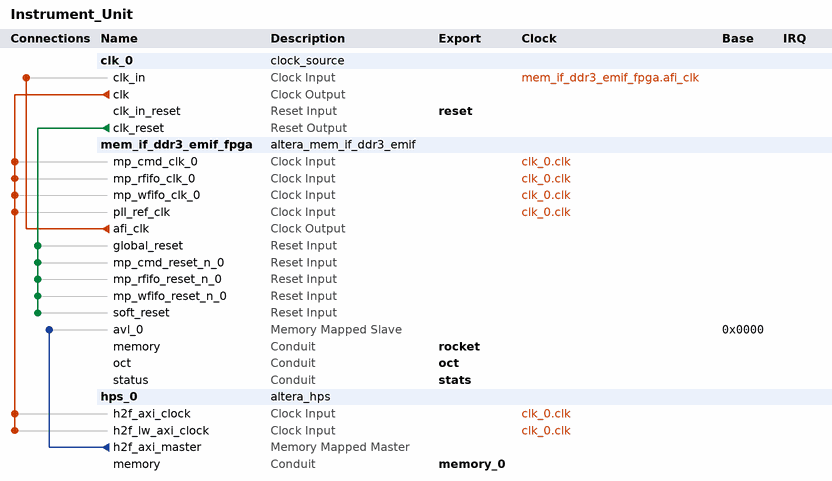
[diagram p0: system contents]
# Platform Designer (Qsys) system Instrument_Unit, Cyclone V 5CSXFC6D6F31C8ES
# Parameters at their usual value, and those the tool derives, are not listed.
package require -exact qsys 14.1
create_system Instrument_Unit
set_project_property DEVICE_FAMILY {Cyclone V}
set_project_property DEVICE 5CSXFC6D6F31C8ES

add_instance clk_0 clock_source 14.1
set_instance_parameter_value clk_0 clockFrequency 50000000

add_instance mem_if_ddr3_emif_fpga altera_mem_if_ddr3_emif 14.1
set_instance_parameter_value mem_if_ddr3_emif_fpga AVL_MAX_SIZE 4
set_instance_parameter_value mem_if_ddr3_emif_fpga CALIBRATION_MODE Full
set_instance_parameter_value mem_if_ddr3_emif_fpga CPORT_TYPE_PORT Bidirectional,Bidirectional,Bidirectional,Bidirectional,Bidirectional,Bidirectional
set_instance_parameter_value mem_if_ddr3_emif_fpga EXPORT_AFI_HALF_CLK false
set_instance_parameter_value mem_if_ddr3_emif_fpga HARD_EMIF true
set_instance_parameter_value mem_if_ddr3_emif_fpga MEM_BANKADDR_WIDTH 3
set_instance_parameter_value mem_if_ddr3_emif_fpga MEM_CLK_FREQ 300.0
set_instance_parameter_value mem_if_ddr3_emif_fpga MEM_CLK_FREQ_MAX 400.0
set_instance_parameter_value mem_if_ddr3_emif_fpga MEM_COL_ADDR_WIDTH 10
set_instance_parameter_value mem_if_ddr3_emif_fpga MEM_DQ_WIDTH 32
set_instance_parameter_value mem_if_ddr3_emif_fpga MEM_FORMAT DISCRETE
set_instance_parameter_value mem_if_ddr3_emif_fpga MEM_ROW_ADDR_WIDTH 15
set_instance_parameter_value mem_if_ddr3_emif_fpga MEM_TCL 6
set_instance_parameter_value mem_if_ddr3_emif_fpga MEM_TFAW_NS 50.0
set_instance_parameter_value mem_if_ddr3_emif_fpga MEM_TRAS_NS 37.5
set_instance_parameter_value mem_if_ddr3_emif_fpga MEM_TRCD_NS 15.0
set_instance_parameter_value mem_if_ddr3_emif_fpga MEM_TRFC_NS 300.0
set_instance_parameter_value mem_if_ddr3_emif_fpga MEM_TRP_NS 15.0
set_instance_parameter_value mem_if_ddr3_emif_fpga MEM_TRRD_NS 13.2
set_instance_parameter_value mem_if_ddr3_emif_fpga MEM_TRTP_NS 13.2
set_instance_parameter_value mem_if_ddr3_emif_fpga MEM_TWTR 4
set_instance_parameter_value mem_if_ddr3_emif_fpga MEM_VENDOR Micron
set_instance_parameter_value mem_if_ddr3_emif_fpga MEM_WTCL 5
set_instance_parameter_value mem_if_ddr3_emif_fpga PLL_LOCATION Top_Bottom
set_instance_parameter_value mem_if_ddr3_emif_fpga POWER_OF_TWO_BUS false
set_instance_parameter_value mem_if_ddr3_emif_fpga PRIORITY_PORT 1,1,1,1,1,1
set_instance_parameter_value mem_if_ddr3_emif_fpga RATE Full
set_instance_parameter_value mem_if_ddr3_emif_fpga REF_CLK_FREQ 50.0
set_instance_parameter_value mem_if_ddr3_emif_fpga SPEED_GRADE 8
set_instance_parameter_value mem_if_ddr3_emif_fpga TIMING_BOARD_AC_SKEW 0.03
set_instance_parameter_value mem_if_ddr3_emif_fpga TIMING_BOARD_AC_TO_CK_SKEW 0.0
set_instance_parameter_value mem_if_ddr3_emif_fpga TIMING_BOARD_DQ_TO_DQS_SKEW 0.0
set_instance_parameter_value mem_if_ddr3_emif_fpga TIMING_BOARD_MAX_CK_DELAY 0.03
set_instance_parameter_value mem_if_ddr3_emif_fpga TIMING_BOARD_MAX_DQS_DELAY 0.03
set_instance_parameter_value mem_if_ddr3_emif_fpga TIMING_BOARD_SKEW_BETWEEN_DQS 0.08
set_instance_parameter_value mem_if_ddr3_emif_fpga TIMING_BOARD_SKEW_CKDQS_DIMM_MAX 0.0
set_instance_parameter_value mem_if_ddr3_emif_fpga TIMING_BOARD_SKEW_CKDQS_DIMM_MIN 0.0
set_instance_parameter_value mem_if_ddr3_emif_fpga TIMING_BOARD_SKEW_WITHIN_DQS 0.01
set_instance_parameter_value mem_if_ddr3_emif_fpga TIMING_TDH 150
set_instance_parameter_value mem_if_ddr3_emif_fpga TIMING_TDQSCK 400
set_instance_parameter_value mem_if_ddr3_emif_fpga TIMING_TDQSQ 200
set_instance_parameter_value mem_if_ddr3_emif_fpga TIMING_TDQSS 0.25
set_instance_parameter_value mem_if_ddr3_emif_fpga TIMING_TDS 75
set_instance_parameter_value mem_if_ddr3_emif_fpga TIMING_TDSH 0.2
set_instance_parameter_value mem_if_ddr3_emif_fpga TIMING_TDSS 0.2
set_instance_parameter_value mem_if_ddr3_emif_fpga TIMING_TIH 275
set_instance_parameter_value mem_if_ddr3_emif_fpga TIMING_TIS 200
set_instance_parameter_value mem_if_ddr3_emif_fpga TIMING_TQSH 0.38
set_instance_parameter_value mem_if_ddr3_emif_fpga USER_DEBUG_LEVEL 1

add_instance hps_0 altera_hps 14.1
set_instance_parameter_value hps_0 EMAC1_Mode N/A
set_instance_parameter_value hps_0 EMAC1_PinMuxing Unused
set_instance_parameter_value hps_0 F2SCLK_COLDRST_Enable false
set_instance_parameter_value hps_0 F2SCLK_DBGRST_Enable false
set_instance_parameter_value hps_0 F2SCLK_WARMRST_Enable false
set_instance_parameter_value hps_0 F2SINTERRUPT_Enable false
set_instance_parameter_value hps_0 F2S_Width 0
set_instance_parameter_value hps_0 FPGA_PERIPHERAL_OUTPUT_CLOCK_FREQ_EMAC0_GTX_CLK 100
set_instance_parameter_value hps_0 FPGA_PERIPHERAL_OUTPUT_CLOCK_FREQ_EMAC0_MD_CLK 100
set_instance_parameter_value hps_0 FPGA_PERIPHERAL_OUTPUT_CLOCK_FREQ_EMAC1_GTX_CLK 100
set_instance_parameter_value hps_0 FPGA_PERIPHERAL_OUTPUT_CLOCK_FREQ_EMAC1_MD_CLK 100
set_instance_parameter_value hps_0 HPS_PROTOCOL DDR3
set_instance_parameter_value hps_0 I2C0_Mode N/A
set_instance_parameter_value hps_0 I2C0_PinMuxing Unused
set_instance_parameter_value hps_0 I2C1_Mode N/A
set_instance_parameter_value hps_0 I2C1_PinMuxing Unused
set_instance_parameter_value hps_0 LWH2F_Enable true
set_instance_parameter_value hps_0 MEM_BANKADDR_WIDTH 3
set_instance_parameter_value hps_0 MEM_CLK_FREQ 300.0
set_instance_parameter_value hps_0 MEM_CLK_FREQ_MAX 400.0
set_instance_parameter_value hps_0 MEM_COL_ADDR_WIDTH 8
set_instance_parameter_value hps_0 MEM_DQ_WIDTH 8
set_instance_parameter_value hps_0 MEM_DRV_STR RZQ/6
set_instance_parameter_value hps_0 MEM_ROW_ADDR_WIDTH 12
set_instance_parameter_value hps_0 MEM_RTT_NOM RZQ/6
set_instance_parameter_value hps_0 MEM_RTT_WR {Dynamic ODT off}
set_instance_parameter_value hps_0 MEM_TCL 7
set_instance_parameter_value hps_0 MEM_TFAW_NS 37.5
set_instance_parameter_value hps_0 MEM_TINIT_US 499
set_instance_parameter_value hps_0 MEM_TMRD_CK 3
set_instance_parameter_value hps_0 MEM_TRAS_NS 40.0
set_instance_parameter_value hps_0 MEM_TRCD_NS 15.0
set_instance_parameter_value hps_0 MEM_TREFI_US 7.0
set_instance_parameter_value hps_0 MEM_TRFC_NS 75.0
set_instance_parameter_value hps_0 MEM_TRP_NS 15.0
set_instance_parameter_value hps_0 MEM_TWTR 2
set_instance_parameter_value hps_0 MEM_VENDOR Micron
set_instance_parameter_value hps_0 MEM_WTCL 6
set_instance_parameter_value hps_0 QSPI_Mode N/A
set_instance_parameter_value hps_0 QSPI_PinMuxing Unused
set_instance_parameter_value hps_0 REF_CLK_FREQ 125.0
set_instance_parameter_value hps_0 S2F_Width 1
set_instance_parameter_value hps_0 SDIO_Mode N/A
set_instance_parameter_value hps_0 SDIO_PinMuxing Unused
set_instance_parameter_value hps_0 SPIM1_Mode N/A
set_instance_parameter_value hps_0 SPIM1_PinMuxing Unused
set_instance_parameter_value hps_0 STM_Enable false
set_instance_parameter_value hps_0 TIMING_BOARD_AC_SKEW 0.02
set_instance_parameter_value hps_0 TIMING_BOARD_AC_TO_CK_SKEW 0.0
set_instance_parameter_value hps_0 TIMING_BOARD_DQ_TO_DQS_SKEW 0.0
set_instance_parameter_value hps_0 TIMING_BOARD_MAX_CK_DELAY 0.6
set_instance_parameter_value hps_0 TIMING_BOARD_MAX_DQS_DELAY 0.6
set_instance_parameter_value hps_0 TIMING_BOARD_SKEW_BETWEEN_DQS 0.02
set_instance_parameter_value hps_0 TIMING_BOARD_SKEW_CKDQS_DIMM_MAX 0.01
set_instance_parameter_value hps_0 TIMING_BOARD_SKEW_CKDQS_DIMM_MIN -0.01
set_instance_parameter_value hps_0 TIMING_BOARD_SKEW_WITHIN_DQS 0.02
set_instance_parameter_value hps_0 TIMING_TDH 125
set_instance_parameter_value hps_0 TIMING_TDQSCK 400
set_instance_parameter_value hps_0 TIMING_TDQSQ 120
set_instance_parameter_value hps_0 TIMING_TDS 50
set_instance_parameter_value hps_0 TIMING_TIH 250
set_instance_parameter_value hps_0 TIMING_TIS 175
set_instance_parameter_value hps_0 TIMING_TQSH 0.38
set_instance_parameter_value hps_0 UART0_Mode N/A
set_instance_parameter_value hps_0 UART0_PinMuxing Unused
set_instance_parameter_value hps_0 USB1_Mode N/A
set_instance_parameter_value hps_0 USB1_PinMuxing Unused
set_instance_parameter_value hps_0 desired_cfg_clk_mhz 100.0
set_instance_parameter_value hps_0 desired_qspi_clk_mhz 400.0
set_instance_parameter_value hps_0 eosc1_clk_mhz 50.0
set_instance_parameter_value hps_0 eosc2_clk_mhz 50.0

# connections
add_connection clk_0.clk hps_0.h2f_axi_clock clock
add_connection clk_0.clk hps_0.h2f_lw_axi_clock clock
add_connection clk_0.clk mem_if_ddr3_emif_fpga.mp_cmd_clk_0 clock
add_connection clk_0.clk mem_if_ddr3_emif_fpga.mp_rfifo_clk_0 clock
add_connection clk_0.clk mem_if_ddr3_emif_fpga.mp_wfifo_clk_0 clock
add_connection clk_0.clk mem_if_ddr3_emif_fpga.pll_ref_clk clock
add_connection mem_if_ddr3_emif_fpga.afi_clk clk_0.clk_in clock
add_connection clk_0.clk_reset mem_if_ddr3_emif_fpga.global_reset reset
add_connection clk_0.clk_reset mem_if_ddr3_emif_fpga.mp_cmd_reset_n_0 reset
add_connection clk_0.clk_reset mem_if_ddr3_emif_fpga.mp_rfifo_reset_n_0 reset
add_connection clk_0.clk_reset mem_if_ddr3_emif_fpga.mp_wfifo_reset_n_0 reset
add_connection clk_0.clk_reset mem_if_ddr3_emif_fpga.soft_reset reset
add_connection hps_0.h2f_axi_master mem_if_ddr3_emif_fpga.avl_0 avalon
set_connection_parameter_value hps_0.h2f_axi_master/mem_if_ddr3_emif_fpga.avl_0 baseAddress 0x0000

# exported interfaces
add_interface memory_0 conduit end
set_interface_property memory_0 EXPORT_OF hps_0.memory
add_interface oct conduit end
set_interface_property oct EXPORT_OF mem_if_ddr3_emif_fpga.oct
add_interface reset reset sink
set_interface_property reset EXPORT_OF clk_0.clk_in_reset
add_interface rocket conduit end
set_interface_property rocket EXPORT_OF mem_if_ddr3_emif_fpga.memory
add_interface stats conduit end
set_interface_property stats EXPORT_OF mem_if_ddr3_emif_fpga.status

set_interconnect_requirement {$system} qsys_mm.clockCrossingAdapter HANDSHAKE
set_interconnect_requirement {$system} qsys_mm.insertDefaultSlave FALSE
set_interconnect_requirement {$system} qsys_mm.maxAdditionalLatency 1

save_system Instrument_Unit.qsys
